# Altium schematic sheet obc.SchDoc
size A4
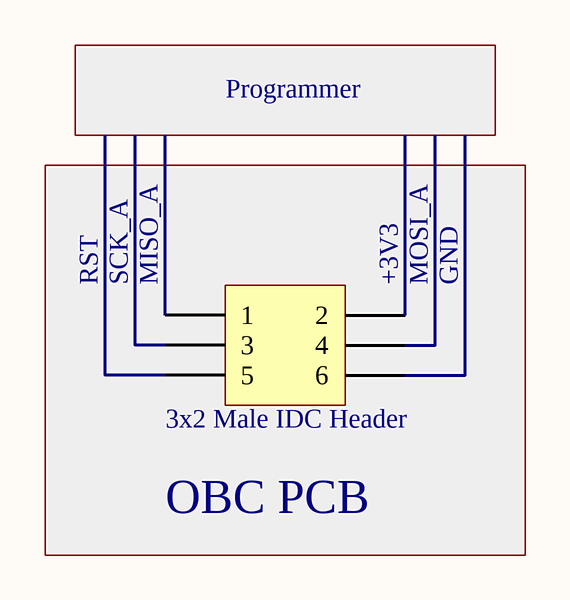
[diagram p0: obc.SchDoc]

## Parts
P?  Header 3X2  [HDR2X3]  (value not drawn)

## Blocks framed on the sheet
OBC PCB: P?

## Nets

Not connected (* = marked no-connect by the designer): P? 1 2 3 4 5 6

## Notes on the sheet
- Programmer
- RST
- (near P?) SCK_A
- (near P?) MISO_A
- (near P?) +3V3
- (near P?) MOSI_A
- (near P?) GND
- (near P?) 3x2 Male IDC Header

## Library data of the parts
P? = Header 3X2: Header, 3-Pin, Dual row; LatestRevisionDate: 17-Jul-2002; LatestRevisionNote: Re-released for DXP Platform.; Publisher: Altium Limited